# Altium schematic sheet Sheet1.SchDoc
size A4; SheetNumber: 1; SheetTotal: 2
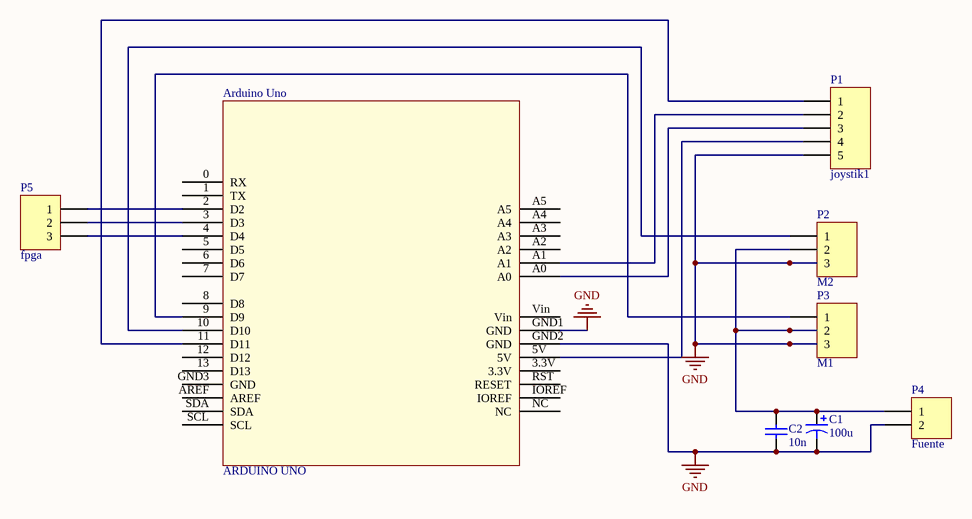
[diagram p0: Sheet1.SchDoc]

## Parts
Arduino_Uno  ARDUINO UNO  [ARDUINO UNO]
C1  value 100u  [CAP ELEC 10x16x5]  (hidden comment: Capacitor polarizado)
C2  value 10n  [Capacitor ceramico 0.2 inch pitch]  (hidden comment: Capacitor no polarizado)
P1  joystik1  [HDR1X5]
P2  M2  [HDR1X3]
P3  M1  [HDR1X3]
P4  Fuente  [HDR1X2]
P5  fpga  [HDR1X3]

## Nets
GND: Arduino_Uno.GND1(GND) Arduino_Uno.GND2(GND) C1.2 C2.1 P1.5 P2.3 P3.3 P4.2
NetArduino_Uno_2: Arduino_Uno.2(D2) P5.1
NetArduino_Uno_3: Arduino_Uno.3(D3) P5.2
NetArduino_Uno_4: Arduino_Uno.4(D4) P5.3
NetArduino_Uno_5V: Arduino_Uno.5V P1.4
NetArduino_Uno_9: Arduino_Uno.9(D9) P3.1
NetArduino_Uno_10: Arduino_Uno.10(D10) P2.1
NetArduino_Uno_11: Arduino_Uno.11(D11) P1.1
NetArduino_Uno_A0: Arduino_Uno.A0 P1.3
NetArduino_Uno_A1: Arduino_Uno.A1 P1.2
NetC1_1: C1.1 C2.2 P2.2 P3.2 P4.1

Not connected (* = marked no-connect by the designer): Arduino_Uno 0(RX) 1(TX) 3.3V 5(D5) 6(D6) 7(D7) 8(D8) 12(D12) 13(D13) A2 A3 A4 A5 AREF GND3(GND) IOREF NC RST(RESET) SCL SDA Vin

## Library data of the parts
P1 = Header 5: Header, 5-Pin; LatestRevisionDate: 17-Jul-2002; LatestRevisionNote: Re-released for DXP Platform.; Publisher: Altium Limited
P2 P3 P5 = Header 3: Header, 3-Pin; LatestRevisionDate: 17-Jul-2002; LatestRevisionNote: Re-released for DXP Platform.; Publisher: Altium Limited
P4 = Header 2: Header, 2-Pin; LatestRevisionDate: 17-Jul-2002; LatestRevisionNote: Re-released for DXP Platform.; Publisher: Altium Limited